# Altium schematic sheet 3b_Motor_Interface.SchDoc
size B
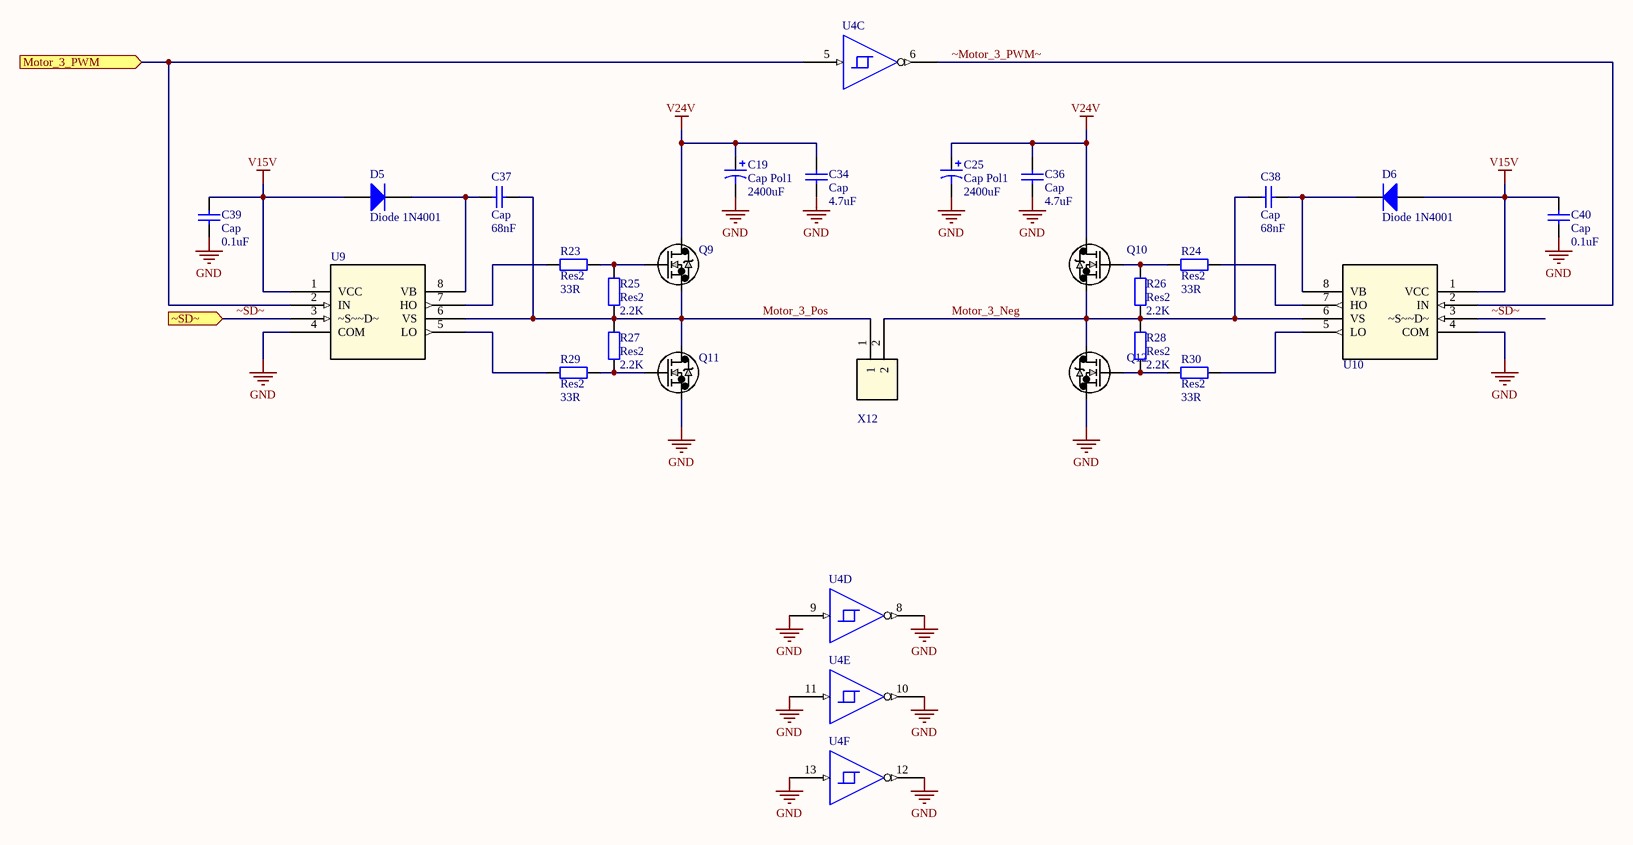
[diagram p0: 3b_Motor_Interface.SchDoc]

## Parts
C19  Cap Pol1  value 2400uF  [RB7.6-15]
C25  Cap Pol1  value 2400uF  [RB7.6-15]
C34  Cap  value 4.7uF  [RAD-0.3]
C36  Cap  value 4.7uF  [RAD-0.3]
C37  Cap  value 68nF  [RAD-0.3]
C38  Cap  value 68nF  [RAD-0.3]
C39  Cap  value 0.1uF  [RAD-0.3]
C40  Cap  value 0.1uF  [RAD-0.3]
D5  Diode 1N4001  [DO-41]
D6  Diode 1N4001  [DO-41]
Q9  STP100N6F7  [TO-220]  (value not drawn)
Q10  STP100N6F7  [TO-220]  (value not drawn)
Q11  STP100N6F7  [TO-220]  (value not drawn)
Q12  STP100N6F7  [TO-220]  (value not drawn)
R23  Res2  value 33R  [AXIAL-0.4]
R24  Res2  value 33R  [AXIAL-0.4]
R25  Res2  value 2.2K  [AXIAL-0.4]
R26  Res2  value 2.2K  [AXIAL-0.4]
R27  Res2  value 2.2K  [AXIAL-0.4]
R28  Res2  value 2.2K  [AXIAL-0.4]
R29  Res2  value 33R  [AXIAL-0.4]
R30  Res2  value 33R  [AXIAL-0.4]
U4  IC HEX SCHMITT-TRIG INV 14-DIP  [14-DIP]  (value not drawn)  (parts C,D,E,F of 6)
U9  IC DRIVER HALF BRIDGE 8DIP  [8-DIP]  (value not drawn)
U10  IC DRIVER HALF BRIDGE 8DIP  [8-DIP]  (value not drawn)
X12  TERM BLOCK HDR 2POS VERT 3.5MM  [WR-TBL-3211 2]  (value not drawn)

## Ports
Motor_3_PWM (in), ~SD~ (in)

## Nets
GND: C19.2 C25.2 C34.1 C36.1 C39.1 C40.1 Q11.3 Q12.3 U4.8(Y) U4.9(A) U4.10(Y) U4.11(A) U4.12(Y) U4.13(A) U9.4(COM) U10.4(COM)
V15V: C39.2 C40.2 D5.1(A) D6.1(A) U9.1(VCC) U10.1(VCC)
V24V: C19.1 C25.1 C34.2 C36.2 Q9.2 Q10.2
Motor_3_Neg: C38.1 Q10.3 Q12.2 R26.2 R28.1 U10.6(VS) X12.2
Motor_3_Pos: C37.1 Q9.3 Q11.2 R25.2 R27.1 U9.6(VS) X12.1
Motor_3_PWM: U4.5(A) U9.2(IN) ; port Motor_3_PWM
~Motor_3_PWM~: U4.6(Y) U10.2(IN)
~SD~: U9.3(~S~~D~) U10.3(~S~~D~) ; port ~SD~
NetC37_2: C37.2 D5.2(K) U9.8(VB)
NetC38_2: C38.2 D6.2(K) U10.8(VB)
NetQ9_1: Q9.1 R23.1 R25.1
NetQ10_1: Q10.1 R24.1 R26.1
NetQ11_1: Q11.1 R27.2 R29.1
NetQ12_1: Q12.1 R28.2 R30.1
NetR23_2: R23.2 U9.7(HO)
NetR24_2: R24.2 U10.7(HO)
NetR29_2: R29.2 U9.5(LO)
NetR30_2: R30.2 U10.5(LO)

## Notes on the sheet
- ESE
- is the sole property of ESE. Any reproduction
- The Information Contained in this drawing
- Schematic P/N and Name
- Sheet Name
- 299 Doon Valley Drive
- Kitchener, ON N2G 4M4
- Canada
- Approved
- in part or in whole without the written
- permission of ESE is strictly prohibited.
- APPROVALS
- DATE
- Size
- Scale
- B
- NTS
- Bare PCB P/N
- Date
- Sheet
- Rev.
- Checked
- Engineer
- of

## Library data of the parts
C19 C25 = Cap Pol1: Polarized Capacitor (Radial); Published: 8-Jun-2000; LatestRevisionDate: 17-Jul-2002; LatestRevisionNote: Re-released for DXP Platform.; PackageReference: RB7.6-15; Publisher: Altium Limited; PackageDescription: Polarized Capacitor (Radial); 2 Leads
C34 C36-C40 = Cap: Capacitor; Published: 8-Jun-2000; LatestRevisionDate: 17-Jul-2002; LatestRevisionNote: Re-released for DXP Platform.; PackageReference: RAD-0.3; Publisher: Altium Limited; PackageDescription: Radial Cap, Thru-Hole; 2 Leads; 0.3 in Pin Spacing
D5 D6 = Diode 1N4001: 1 Amp General Purpose Rectifier; Published: 8-Jun-2000; LatestRevisionDate: 17-Jul-2002; LatestRevisionNote: Re-released for DXP Platform.; DatasheetVersion: 1998; PackageVersion: Aug-1999; PackageReference: DO-41; Publisher: Altium Limited; PackageDescription: Diode, Axial; Body 5.2 x 2.7 mm (LxDia. max), Lead Dia. 0.86 mm (max); Code_JEDEC: DO-204-AL; ComponentLink1Description: Manufacturer Link; ComponentLink1URL: http://www.fairchildsemi.com/; ComponentLink2Description: Datasheet; ComponentLink2URL: http://www.fairchildsemi.com/ds/1N%2F1N4001.pdf
Q9-Q12 = STP100N6F7: Vendor: STMicroelectronics; Manufacturer_Part_Number: STP100N6F7; Digi-Key_Part_Number: 497-15888-5-ND
R23-R30 = Res2: Resistor; Published: 8-Jun-2000; LatestRevisionDate: 17-Jul-2002; LatestRevisionNote: Re-released for DXP Platform.; PackageReference: AXIAL-0.4; Publisher: Altium Limited; PackageDescription: Axial Device, Thru-Hole; 2 Leads; 0.4 in Pin Spacing
U4 = IC HEX SCHMITT-TRIG INV 14-DIP: Manufactuer_Part_Number: SN74ACT14N; Manufacturer: Texas Instruments; Digi-Key_Part_Number: 296-4368-5-ND
U9 U10 = IC DRIVER HALF BRIDGE 8DIP: Manufacturer_Part_Number: IR2109PBF; Manufacturer: Infineon Technologies; Digi-Key_Part_Number: IR2109PBF-ND
X12 = TERM BLOCK HDR 2POS VERT 3.5MM: Manufacturer_Part_Number: 691321100002; Manufacturer: Wurth Electronics Inc; DigiKey_Part_Number: 732-2763-ND